# Altium schematic sheet RP2040.SchDoc
size A; SheetNumber: 1; SheetTotal: 2
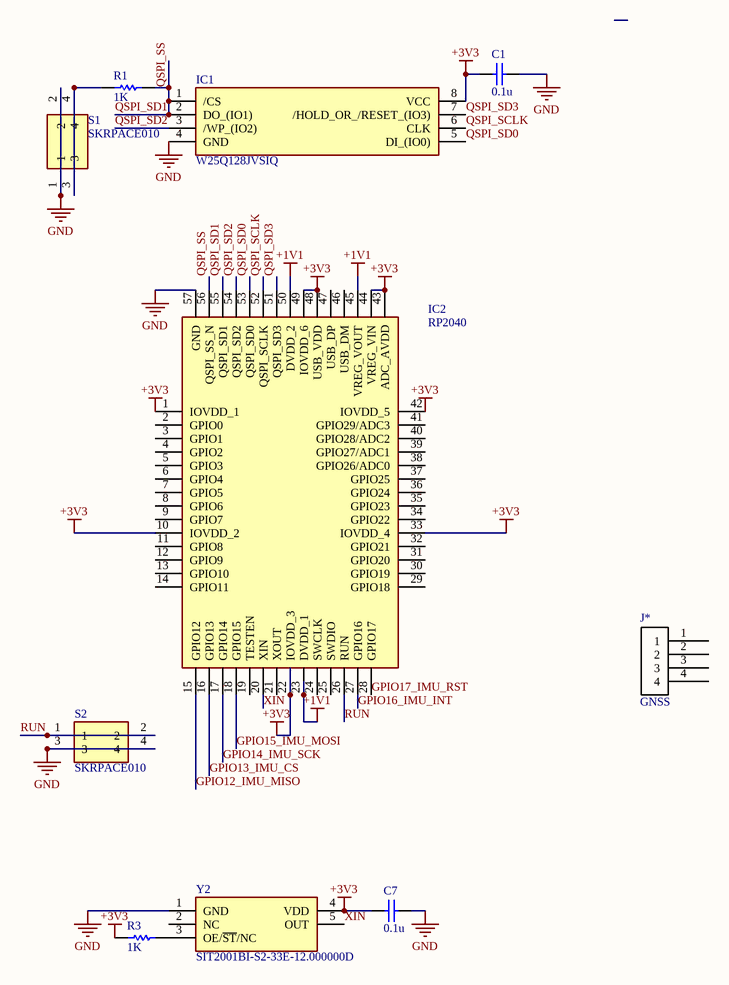
[diagram p0: RP2040.SchDoc]

## Parts
C1  value 0.1u  [1608[0603]]  (hidden comment: Capacitor)
C7  value 0.1u  [1608[0603]]  (hidden comment: Capacitor)
IC1  W25Q128JVSIQ  [SOIC127P790X216-8N]
IC2  RP2040  [QFN40P700X700X90-57N-D]
J*  GNSS
R1  value 1K  [1608[0603]]  (hidden comment: Resistor)
R3  value 1K  [1608[0603]]  (hidden comment: Resistor)
S1  SKRPACE010  [SMT(4.2X3.2)]
S2  SKRPACE010  [SMT(4.2X3.2)]
Y2  SIT2001BI-S2-33E-12.000000D  [SOT95P280X145-5N]

## Nets
+1V1: IC2.23(DVDD_1) IC2.45(VREG_VOUT) IC2.50(DVDD_2)
+3V3: C1.1 C7.1 IC1.8(VCC) IC2.1(IOVDD_1) IC2.10(IOVDD_2) IC2.22(IOVDD_3) IC2.33(IOVDD_4) IC2.42(IOVDD_5) IC2.43(ADC_AVDD) IC2.44(VREG_VIN) IC2.48(USB_VDD) IC2.49(IOVDD_6) R3.1 Y2.4(VDD)
GND: C1.2 C7.2 IC1.4(GND) IC2.57(GND) S1.1 S1.2 S2.3 S2.4 Y2.1(GND)
GPIO12_IMU_MISO: IC2.15(GPIO12)
GPIO13_IMU_CS: IC2.16(GPIO13)
GPIO14_IMU_SCK: IC2.17(GPIO14)
GPIO15_IMU_MOSI: IC2.18(GPIO15)
GPIO16_IMU_INT: IC2.27(GPIO16)
GPIO17_IMU_RST: IC2.28(GPIO17)
QSPI_SCLK: IC1.6(CLK) IC2.52(QSPI_SCLK)
QSPI_SD0: IC1.5(DI_(IO0)) IC2.53(QSPI_SD0)
QSPI_SD1: IC1.1(/CS) IC1.2(DO_(IO1)) IC2.55(QSPI_SD1) IC2.56(QSPI_SS_N) R1.2  [also labelled QSPI_SS]
QSPI_SD2: IC1.3(/WP_(IO2)) IC2.54(QSPI_SD2)
QSPI_SD3: IC1.7(/HOLD_OR_/RESET_(IO3)) IC2.51(QSPI_SD3)
RUN: IC2.26(RUN) S2.1 S2.2
XIN: IC2.20(XIN) Y2.5(OUT)
NetR1_1: R1.1 S1.3 S1.4
NetR3_2: R3.2 Y2.3(OE/~{ST}/NC)

Not connected (* = marked no-connect by the designer): IC2 2(GPIO0) 3(GPIO1) 4(GPIO2) 5(GPIO3) 6(GPIO4) 7(GPIO5) 8(GPIO6) 9(GPIO7) 11(GPIO8) 12(GPIO9) 13(GPIO10) 14(GPIO11) 19(TESTEN) 21(XOUT) 24(SWCLK) 25(SWDIO) 29(GPIO18) 30(GPIO19) 31(GPIO20) 32(GPIO21) 34(GPIO22) 35(GPIO23) 36(GPIO24) 37(GPIO25) 38(GPIO26/ADC0) 39(GPIO27/ADC1) 40(GPIO28/ADC2) 41(GPIO29/ADC3) 46(USB_DM) 47(USB_DP); J* 1 2 3 4; Y2 2(NC)

## Library data of the parts
C1 C7 = Capacitor: SimulationGenericComponent: True
IC1 = W25Q128JVSIQ: Integrated Circuit; Manufacturer_Name: Winbond; Datasheet Link: https://www.winbond.com/hq/search-resource-file.jsp?partNo=W25Q128JVSIQ&type=datasheet; Height: 2.16mm; Manufacturer_Part_Number: W25Q128JVSIQ; Mouser Part Number: 454-W25Q128JVSIQ; Mouser Price/Stock: https://www.mouser.co.uk/ProductDetail/Winbond/W25Q128JVSIQ?qs=qSfuJ%252Bfl%2Fd6tLXvPR4fl9w%3D%3D; Arrow Part Number: W25Q128JVSIQ; Arrow Price/Stock: https://www.arrow.com/en/products/w25q128jvsiq/winbond-electronics?region=nac
IC2 = RP2040: Integrated Circuit; Manufacturer_Name: RASPBERRY-PI; Datasheet Link: https://datasheets.raspberrypi.org/rp2040/rp2040-datasheet.pdf; Height: 0.9mm; Manufacturer_Part_Number: RP2040
J* = PinHeader_1.27_4_Half
R1 R3 = Resistor: TC1: 0; SimulationGenericComponent: True; TC2: 0
S1 S2 = SKRPACE010: Switch; Manufacturer_Name: ALPS Electric; Datasheet Link: http://www.alps.com/prod/info/E/HTML/Tact/SurfaceMount/SKRP/SKRPACE010.html; Manufacturer_Part_Number: SKRPACE010; Mouser Part Number: 688-SKRPACE010; Mouser Price/Stock: https://www.mouser.co.uk/ProductDetail/Alps-Alpine/SKRPACE010?qs=dHDuPHwQO79W8iY66hDbLQ%3D%3D; Arrow Part Number: SKRPACE010; Arrow Price/Stock: https://www.arrow.com/en/products/skrpace010/alps-electric
Y2 = SIT2001BI-S2-33E-12.000000D: Crystal or Oscillator; Manufacturer_Name: SiTime; Datasheet Link: https://www.sitime.com/datasheet/SiT2001; Height: 1.45mm; Manufacturer_Part_Number: SIT2001BI-S2-33E-12.000000D